# Altium schematic sheet 14_SD.SchDoc
size A4
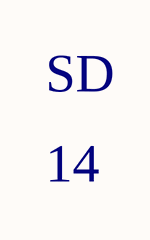
[diagram p0: 14_SD.SchDoc]

## Notes on the sheet
- SD
- 14